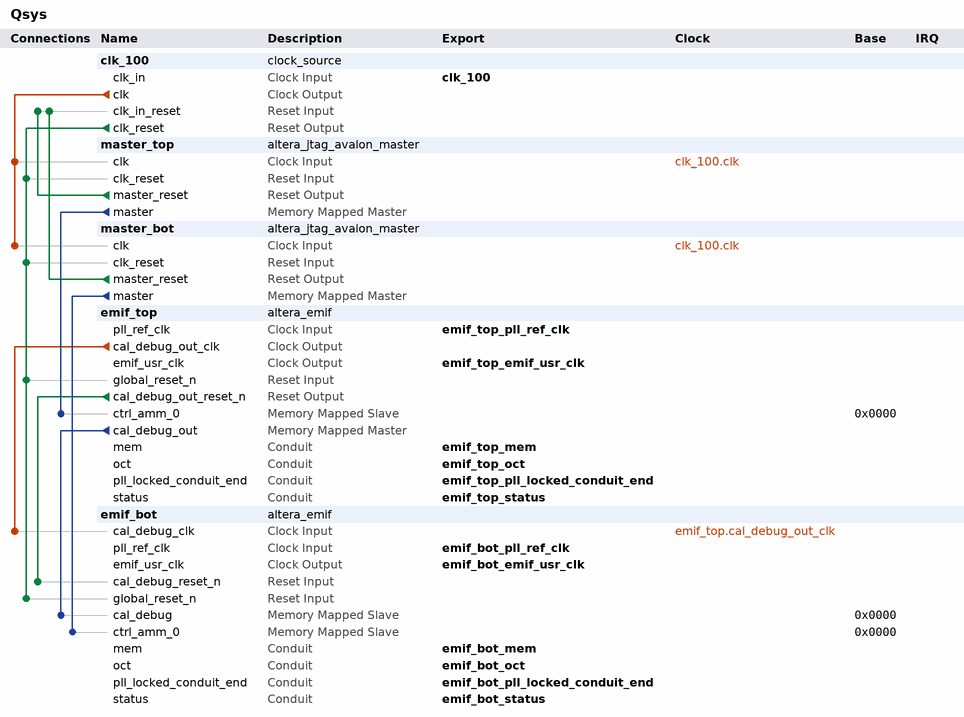
[diagram p0: system contents]
# Platform Designer (Qsys) system Qsys, Arria 10 10AXF40AA
# Parameters at their usual value, and those the tool derives, are not listed.
package require -exact qsys 20.1
create_system Qsys
set_project_property DEVICE_FAMILY {Arria 10}
set_project_property DEVICE 10AXF40AA

add_instance clk_100 clock_source 20.1
set_instance_parameter_value clk_100 clockFrequency 100000000

add_instance master_top altera_jtag_avalon_master 20.1

add_instance master_bot altera_jtag_avalon_master 20.1

add_instance emif_top altera_emif 20.1
set_instance_parameter_value emif_top BOARD_DDR3_AC_TO_CK_SKEW_NS 0.0
set_instance_parameter_value emif_top BOARD_DDR3_BRD_SKEW_WITHIN_AC_NS 0.02
set_instance_parameter_value emif_top BOARD_DDR3_BRD_SKEW_WITHIN_DQS_NS 0.02
set_instance_parameter_value emif_top BOARD_DDR3_DQS_TO_CK_SKEW_NS 0.02
set_instance_parameter_value emif_top BOARD_DDR3_IS_SKEW_WITHIN_AC_DESKEWED true
set_instance_parameter_value emif_top BOARD_DDR3_IS_SKEW_WITHIN_DQS_DESKEWED false
set_instance_parameter_value emif_top BOARD_DDR3_MAX_CK_DELAY_NS 0.6
set_instance_parameter_value emif_top BOARD_DDR3_MAX_DQS_DELAY_NS 0.6
set_instance_parameter_value emif_top BOARD_DDR3_PKG_BRD_SKEW_WITHIN_AC_NS 0.02
set_instance_parameter_value emif_top BOARD_DDR3_PKG_BRD_SKEW_WITHIN_DQS_NS 0.02
set_instance_parameter_value emif_top BOARD_DDR3_SKEW_BETWEEN_DIMMS_NS 0.05
set_instance_parameter_value emif_top BOARD_DDR3_SKEW_BETWEEN_DQS_NS 0.02
set_instance_parameter_value emif_top BOARD_DDR3_USER_AC_ISI_NS 0.0
set_instance_parameter_value emif_top BOARD_DDR3_USER_AC_SLEW_RATE 2.0
set_instance_parameter_value emif_top BOARD_DDR3_USER_CK_SLEW_RATE 4.0
set_instance_parameter_value emif_top BOARD_DDR3_USER_RCLK_ISI_NS 0.0
set_instance_parameter_value emif_top BOARD_DDR3_USER_RCLK_SLEW_RATE 5.0
set_instance_parameter_value emif_top BOARD_DDR3_USER_RDATA_ISI_NS 0.0
set_instance_parameter_value emif_top BOARD_DDR3_USER_RDATA_SLEW_RATE 2.5
set_instance_parameter_value emif_top BOARD_DDR3_USER_WCLK_ISI_NS 0.0
set_instance_parameter_value emif_top BOARD_DDR3_USER_WCLK_SLEW_RATE 4.0
set_instance_parameter_value emif_top BOARD_DDR3_USER_WDATA_ISI_NS 0.0
set_instance_parameter_value emif_top BOARD_DDR3_USER_WDATA_SLEW_RATE 2.0
set_instance_parameter_value emif_top BOARD_DDR3_USE_DEFAULT_ISI_VALUES true
set_instance_parameter_value emif_top BOARD_DDR3_USE_DEFAULT_SLEW_RATES true
set_instance_parameter_value emif_top BOARD_DDR4_AC_TO_CK_SKEW_NS 0.0
set_instance_parameter_value emif_top BOARD_DDR4_BRD_SKEW_WITHIN_AC_NS 0.02
set_instance_parameter_value emif_top BOARD_DDR4_BRD_SKEW_WITHIN_DQS_NS 0.02
set_instance_parameter_value emif_top BOARD_DDR4_DQS_TO_CK_SKEW_NS 0.02
set_instance_parameter_value emif_top BOARD_DDR4_IS_SKEW_WITHIN_AC_DESKEWED false
set_instance_parameter_value emif_top BOARD_DDR4_IS_SKEW_WITHIN_DQS_DESKEWED true
set_instance_parameter_value emif_top BOARD_DDR4_MAX_CK_DELAY_NS 0.6
set_instance_parameter_value emif_top BOARD_DDR4_MAX_DQS_DELAY_NS 0.6
set_instance_parameter_value emif_top BOARD_DDR4_PKG_BRD_SKEW_WITHIN_AC_NS 0.02
set_instance_parameter_value emif_top BOARD_DDR4_PKG_BRD_SKEW_WITHIN_DQS_NS 0.02
set_instance_parameter_value emif_top BOARD_DDR4_SKEW_BETWEEN_DIMMS_NS 0.05
set_instance_parameter_value emif_top BOARD_DDR4_SKEW_BETWEEN_DQS_NS 0.02
set_instance_parameter_value emif_top BOARD_DDR4_USER_AC_ISI_NS 0.0
set_instance_parameter_value emif_top BOARD_DDR4_USER_AC_SLEW_RATE 2.0
set_instance_parameter_value emif_top BOARD_DDR4_USER_CK_SLEW_RATE 4.0
set_instance_parameter_value emif_top BOARD_DDR4_USER_RCLK_ISI_NS 0.0
set_instance_parameter_value emif_top BOARD_DDR4_USER_RCLK_SLEW_RATE 8.0
set_instance_parameter_value emif_top BOARD_DDR4_USER_RDATA_ISI_NS 0.0
set_instance_parameter_value emif_top BOARD_DDR4_USER_RDATA_SLEW_RATE 4.0
set_instance_parameter_value emif_top BOARD_DDR4_USER_WCLK_ISI_NS 0.0
set_instance_parameter_value emif_top BOARD_DDR4_USER_WCLK_SLEW_RATE 4.0
set_instance_parameter_value emif_top BOARD_DDR4_USER_WDATA_ISI_NS 0.0
set_instance_parameter_value emif_top BOARD_DDR4_USER_WDATA_SLEW_RATE 2.0
set_instance_parameter_value emif_top BOARD_DDR4_USE_DEFAULT_ISI_VALUES true
set_instance_parameter_value emif_top BOARD_DDR4_USE_DEFAULT_SLEW_RATES true
set_instance_parameter_value emif_top BOARD_LPDDR3_AC_TO_CK_SKEW_NS 0.0
set_instance_parameter_value emif_top BOARD_LPDDR3_BRD_SKEW_WITHIN_AC_NS 0.02
set_instance_parameter_value emif_top BOARD_LPDDR3_BRD_SKEW_WITHIN_DQS_NS 0.02
set_instance_parameter_value emif_top BOARD_LPDDR3_DQS_TO_CK_SKEW_NS 0.02
set_instance_parameter_value emif_top BOARD_LPDDR3_IS_SKEW_WITHIN_AC_DESKEWED true
set_instance_parameter_value emif_top BOARD_LPDDR3_IS_SKEW_WITHIN_DQS_DESKEWED false
set_instance_parameter_value emif_top BOARD_LPDDR3_MAX_CK_DELAY_NS 0.6
set_instance_parameter_value emif_top BOARD_LPDDR3_MAX_DQS_DELAY_NS 0.6
set_instance_parameter_value emif_top BOARD_LPDDR3_PKG_BRD_SKEW_WITHIN_AC_NS 0.02
set_instance_parameter_value emif_top BOARD_LPDDR3_PKG_BRD_SKEW_WITHIN_DQS_NS 0.02
set_instance_parameter_value emif_top BOARD_LPDDR3_SKEW_BETWEEN_DIMMS_NS 0.05
set_instance_parameter_value emif_top BOARD_LPDDR3_SKEW_BETWEEN_DQS_NS 0.02
set_instance_parameter_value emif_top BOARD_LPDDR3_USER_AC_ISI_NS 0.0
set_instance_parameter_value emif_top BOARD_LPDDR3_USER_AC_SLEW_RATE 2.0
set_instance_parameter_value emif_top BOARD_LPDDR3_USER_CK_SLEW_RATE 4.0
set_instance_parameter_value emif_top BOARD_LPDDR3_USER_RCLK_ISI_NS 0.0
set_instance_parameter_value emif_top BOARD_LPDDR3_USER_RCLK_SLEW_RATE 4.0
set_instance_parameter_value emif_top BOARD_LPDDR3_USER_RDATA_ISI_NS 0.0
set_instance_parameter_value emif_top BOARD_LPDDR3_USER_RDATA_SLEW_RATE 2.0
set_instance_parameter_value emif_top BOARD_LPDDR3_USER_WCLK_ISI_NS 0.0
set_instance_parameter_value emif_top BOARD_LPDDR3_USER_WCLK_SLEW_RATE 4.0
set_instance_parameter_value emif_top BOARD_LPDDR3_USER_WDATA_ISI_NS 0.0
set_instance_parameter_value emif_top BOARD_LPDDR3_USER_WDATA_SLEW_RATE 2.0
set_instance_parameter_value emif_top BOARD_LPDDR3_USE_DEFAULT_ISI_VALUES true
set_instance_parameter_value emif_top BOARD_LPDDR3_USE_DEFAULT_SLEW_RATES true
set_instance_parameter_value emif_top BOARD_QDR2_AC_TO_K_SKEW_NS 0.0
set_instance_parameter_value emif_top BOARD_QDR2_BRD_SKEW_WITHIN_AC_NS 0.02
set_instance_parameter_value emif_top BOARD_QDR2_BRD_SKEW_WITHIN_D_NS 0.02
set_instance_parameter_value emif_top BOARD_QDR2_BRD_SKEW_WITHIN_Q_NS 0.02
set_instance_parameter_value emif_top BOARD_QDR2_IS_SKEW_WITHIN_AC_DESKEWED true
set_instance_parameter_value emif_top BOARD_QDR2_IS_SKEW_WITHIN_D_DESKEWED false
set_instance_parameter_value emif_top BOARD_QDR2_IS_SKEW_WITHIN_Q_DESKEWED false
set_instance_parameter_value emif_top BOARD_QDR2_MAX_K_DELAY_NS 0.6
set_instance_parameter_value emif_top BOARD_QDR2_PKG_BRD_SKEW_WITHIN_AC_NS 0.02
set_instance_parameter_value emif_top BOARD_QDR2_PKG_BRD_SKEW_WITHIN_D_NS 0.02
set_instance_parameter_value emif_top BOARD_QDR2_PKG_BRD_SKEW_WITHIN_Q_NS 0.02
set_instance_parameter_value emif_top BOARD_QDR2_USER_AC_ISI_NS 0.0
set_instance_parameter_value emif_top BOARD_QDR2_USER_AC_SLEW_RATE 2.0
set_instance_parameter_value emif_top BOARD_QDR2_USER_K_SLEW_RATE 4.0
set_instance_parameter_value emif_top BOARD_QDR2_USER_RCLK_ISI_NS 0.0
set_instance_parameter_value emif_top BOARD_QDR2_USER_RCLK_SLEW_RATE 4.0
set_instance_parameter_value emif_top BOARD_QDR2_USER_RDATA_ISI_NS 0.0
set_instance_parameter_value emif_top BOARD_QDR2_USER_RDATA_SLEW_RATE 2.0
set_instance_parameter_value emif_top BOARD_QDR2_USER_WCLK_ISI_NS 0.0
set_instance_parameter_value emif_top BOARD_QDR2_USER_WDATA_ISI_NS 0.0
set_instance_parameter_value emif_top BOARD_QDR2_USER_WDATA_SLEW_RATE 2.0
set_instance_parameter_value emif_top BOARD_QDR2_USE_DEFAULT_ISI_VALUES true
set_instance_parameter_value emif_top BOARD_QDR2_USE_DEFAULT_SLEW_RATES true
set_instance_parameter_value emif_top BOARD_QDR4_AC_TO_CK_SKEW_NS 0.0
set_instance_parameter_value emif_top BOARD_QDR4_BRD_SKEW_WITHIN_AC_NS 0.02
set_instance_parameter_value emif_top BOARD_QDR4_BRD_SKEW_WITHIN_QK_NS 0.02
set_instance_parameter_value emif_top BOARD_QDR4_DK_TO_CK_SKEW_NS -0.02
set_instance_parameter_value emif_top BOARD_QDR4_IS_SKEW_WITHIN_AC_DESKEWED true
set_instance_parameter_value emif_top BOARD_QDR4_IS_SKEW_WITHIN_QK_DESKEWED true
set_instance_parameter_value emif_top BOARD_QDR4_MAX_CK_DELAY_NS 0.6
set_instance_parameter_value emif_top BOARD_QDR4_MAX_DK_DELAY_NS 0.6
set_instance_parameter_value emif_top BOARD_QDR4_PKG_BRD_SKEW_WITHIN_AC_NS 0.02
set_instance_parameter_value emif_top BOARD_QDR4_PKG_BRD_SKEW_WITHIN_QK_NS 0.02
set_instance_parameter_value emif_top BOARD_QDR4_SKEW_BETWEEN_DIMMS_NS 0.05
set_instance_parameter_value emif_top BOARD_QDR4_SKEW_BETWEEN_DK_NS 0.02
set_instance_parameter_value emif_top BOARD_QDR4_USER_AC_ISI_NS 0.0
set_instance_parameter_value emif_top BOARD_QDR4_USER_AC_SLEW_RATE 2.0
set_instance_parameter_value emif_top BOARD_QDR4_USER_CK_SLEW_RATE 4.0
set_instance_parameter_value emif_top BOARD_QDR4_USER_RCLK_ISI_NS 0.0
set_instance_parameter_value emif_top BOARD_QDR4_USER_RCLK_SLEW_RATE 5.0
set_instance_parameter_value emif_top BOARD_QDR4_USER_RDATA_ISI_NS 0.0
set_instance_parameter_value emif_top BOARD_QDR4_USER_RDATA_SLEW_RATE 2.5
set_instance_parameter_value emif_top BOARD_QDR4_USER_WCLK_ISI_NS 0.0
set_instance_parameter_value emif_top BOARD_QDR4_USER_WCLK_SLEW_RATE 4.0
set_instance_parameter_value emif_top BOARD_QDR4_USER_WDATA_ISI_NS 0.0
set_instance_parameter_value emif_top BOARD_QDR4_USER_WDATA_SLEW_RATE 2.0
set_instance_parameter_value emif_top BOARD_QDR4_USE_DEFAULT_ISI_VALUES true
set_instance_parameter_value emif_top BOARD_QDR4_USE_DEFAULT_SLEW_RATES true
set_instance_parameter_value emif_top BOARD_RLD3_AC_TO_CK_SKEW_NS 0.0
set_instance_parameter_value emif_top BOARD_RLD3_BRD_SKEW_WITHIN_AC_NS 0.02
set_instance_parameter_value emif_top BOARD_RLD3_BRD_SKEW_WITHIN_QK_NS 0.02
set_instance_parameter_value emif_top BOARD_RLD3_DK_TO_CK_SKEW_NS -0.02
set_instance_parameter_value emif_top BOARD_RLD3_IS_SKEW_WITHIN_AC_DESKEWED true
set_instance_parameter_value emif_top BOARD_RLD3_IS_SKEW_WITHIN_QK_DESKEWED false
set_instance_parameter_value emif_top BOARD_RLD3_MAX_CK_DELAY_NS 0.6
set_instance_parameter_value emif_top BOARD_RLD3_MAX_DK_DELAY_NS 0.6
set_instance_parameter_value emif_top BOARD_RLD3_PKG_BRD_SKEW_WITHIN_AC_NS 0.02
set_instance_parameter_value emif_top BOARD_RLD3_PKG_BRD_SKEW_WITHIN_QK_NS 0.02
set_instance_parameter_value emif_top BOARD_RLD3_SKEW_BETWEEN_DIMMS_NS 0.05
set_instance_parameter_value emif_top BOARD_RLD3_SKEW_BETWEEN_DK_NS 0.02
set_instance_parameter_value emif_top BOARD_RLD3_USER_AC_ISI_NS 0.0
set_instance_parameter_value emif_top BOARD_RLD3_USER_AC_SLEW_RATE 2.0
set_instance_parameter_value emif_top BOARD_RLD3_USER_CK_SLEW_RATE 4.0
set_instance_parameter_value emif_top BOARD_RLD3_USER_RCLK_ISI_NS 0.0
set_instance_parameter_value emif_top BOARD_RLD3_USER_RCLK_SLEW_RATE 7.0
set_instance_parameter_value emif_top BOARD_RLD3_USER_RDATA_ISI_NS 0.0
set_instance_parameter_value emif_top BOARD_RLD3_USER_RDATA_SLEW_RATE 3.5
set_instance_parameter_value emif_top BOARD_RLD3_USER_WCLK_ISI_NS 0.0
set_instance_parameter_value emif_top BOARD_RLD3_USER_WCLK_SLEW_RATE 4.0
set_instance_parameter_value emif_top BOARD_RLD3_USER_WDATA_ISI_NS 0.0
set_instance_parameter_value emif_top BOARD_RLD3_USER_WDATA_SLEW_RATE 2.0
set_instance_parameter_value emif_top BOARD_RLD3_USE_DEFAULT_ISI_VALUES true
set_instance_parameter_value emif_top BOARD_RLD3_USE_DEFAULT_SLEW_RATES true
set_instance_parameter_value emif_top CAL_DEBUG_CLOCK_FREQUENCY 50000000
set_instance_parameter_value emif_top CTRL_DDR3_ADDR_ORDER_ENUM DDR3_CTRL_ADDR_ORDER_CS_R_B_C
set_instance_parameter_value emif_top CTRL_DDR3_AUTO_POWER_DOWN_CYCS 32
set_instance_parameter_value emif_top CTRL_DDR3_AUTO_POWER_DOWN_EN false
set_instance_parameter_value emif_top CTRL_DDR3_AUTO_PRECHARGE_EN false
set_instance_parameter_value emif_top CTRL_DDR3_AVL_PROTOCOL_ENUM CTRL_AVL_PROTOCOL_MM
set_instance_parameter_value emif_top CTRL_DDR3_ECC_AUTO_CORRECTION_EN false
set_instance_parameter_value emif_top CTRL_DDR3_ECC_EN false
set_instance_parameter_value emif_top CTRL_DDR3_MMR_EN false
set_instance_parameter_value emif_top CTRL_DDR3_RD_TO_RD_DIFF_CHIP_DELTA_CYCS 0
set_instance_parameter_value emif_top CTRL_DDR3_RD_TO_WR_DIFF_CHIP_DELTA_CYCS 0
set_instance_parameter_value emif_top CTRL_DDR3_RD_TO_WR_SAME_CHIP_DELTA_CYCS 0
set_instance_parameter_value emif_top CTRL_DDR3_REORDER_EN true
set_instance_parameter_value emif_top CTRL_DDR3_SELF_REFRESH_EN false
set_instance_parameter_value emif_top CTRL_DDR3_STARVE_LIMIT 10
set_instance_parameter_value emif_top CTRL_DDR3_USER_PRIORITY_EN false
set_instance_parameter_value emif_top CTRL_DDR3_USER_REFRESH_EN false
set_instance_parameter_value emif_top CTRL_DDR3_WR_TO_RD_DIFF_CHIP_DELTA_CYCS 0
set_instance_parameter_value emif_top CTRL_DDR3_WR_TO_RD_SAME_CHIP_DELTA_CYCS 0
set_instance_parameter_value emif_top CTRL_DDR3_WR_TO_WR_DIFF_CHIP_DELTA_CYCS 0
set_instance_parameter_value emif_top CTRL_DDR4_ADDR_ORDER_ENUM DDR4_CTRL_ADDR_ORDER_CS_R_B_C_BG
set_instance_parameter_value emif_top CTRL_DDR4_AUTO_POWER_DOWN_CYCS 32
set_instance_parameter_value emif_top CTRL_DDR4_AUTO_POWER_DOWN_EN false
set_instance_parameter_value emif_top CTRL_DDR4_AUTO_PRECHARGE_EN false
set_instance_parameter_value emif_top CTRL_DDR4_AVL_PROTOCOL_ENUM CTRL_AVL_PROTOCOL_MM
set_instance_parameter_value emif_top CTRL_DDR4_ECC_AUTO_CORRECTION_EN true
set_instance_parameter_value emif_top CTRL_DDR4_ECC_EN true
set_instance_parameter_value emif_top CTRL_DDR4_MMR_EN false
set_instance_parameter_value emif_top CTRL_DDR4_RD_TO_RD_DIFF_CHIP_DELTA_CYCS 0
set_instance_parameter_value emif_top CTRL_DDR4_RD_TO_WR_DIFF_CHIP_DELTA_CYCS 0
set_instance_parameter_value emif_top CTRL_DDR4_RD_TO_WR_SAME_CHIP_DELTA_CYCS 0
set_instance_parameter_value emif_top CTRL_DDR4_REORDER_EN true
set_instance_parameter_value emif_top CTRL_DDR4_SELF_REFRESH_EN false
set_instance_parameter_value emif_top CTRL_DDR4_STARVE_LIMIT 10
set_instance_parameter_value emif_top CTRL_DDR4_USER_PRIORITY_EN false
set_instance_parameter_value emif_top CTRL_DDR4_USER_REFRESH_EN false
set_instance_parameter_value emif_top CTRL_DDR4_WR_TO_RD_DIFF_CHIP_DELTA_CYCS 0
set_instance_parameter_value emif_top CTRL_DDR4_WR_TO_RD_SAME_CHIP_DELTA_CYCS 0
set_instance_parameter_value emif_top CTRL_DDR4_WR_TO_WR_DIFF_CHIP_DELTA_CYCS 0
set_instance_parameter_value emif_top CTRL_LPDDR3_ADDR_ORDER_ENUM LPDDR3_CTRL_ADDR_ORDER_CS_R_B_C
set_instance_parameter_value emif_top CTRL_LPDDR3_AUTO_POWER_DOWN_CYCS 32
set_instance_parameter_value emif_top CTRL_LPDDR3_AUTO_POWER_DOWN_EN false
set_instance_parameter_value emif_top CTRL_LPDDR3_AUTO_PRECHARGE_EN false
set_instance_parameter_value emif_top CTRL_LPDDR3_AVL_PROTOCOL_ENUM CTRL_AVL_PROTOCOL_MM
set_instance_parameter_value emif_top CTRL_LPDDR3_MMR_EN false
set_instance_parameter_value emif_top CTRL_LPDDR3_RD_TO_RD_DIFF_CHIP_DELTA_CYCS 0
set_instance_parameter_value emif_top CTRL_LPDDR3_RD_TO_WR_DIFF_CHIP_DELTA_CYCS 0
set_instance_parameter_value emif_top CTRL_LPDDR3_RD_TO_WR_SAME_CHIP_DELTA_CYCS 0
set_instance_parameter_value emif_top CTRL_LPDDR3_REORDER_EN true
set_instance_parameter_value emif_top CTRL_LPDDR3_SELF_REFRESH_EN false
set_instance_parameter_value emif_top CTRL_LPDDR3_STARVE_LIMIT 10
set_instance_parameter_value emif_top CTRL_LPDDR3_USER_PRIORITY_EN false
set_instance_parameter_value emif_top CTRL_LPDDR3_USER_REFRESH_EN false
set_instance_parameter_value emif_top CTRL_LPDDR3_WR_TO_RD_DIFF_CHIP_DELTA_CYCS 0
set_instance_parameter_value emif_top CTRL_LPDDR3_WR_TO_RD_SAME_CHIP_DELTA_CYCS 0
set_instance_parameter_value emif_top CTRL_LPDDR3_WR_TO_WR_DIFF_CHIP_DELTA_CYCS 0
set_instance_parameter_value emif_top CTRL_QDR2_AVL_ENABLE_POWER_OF_TWO_BUS false
set_instance_parameter_value emif_top CTRL_QDR2_AVL_MAX_BURST_COUNT 4
set_instance_parameter_value emif_top CTRL_QDR2_AVL_PROTOCOL_ENUM CTRL_AVL_PROTOCOL_MM
set_instance_parameter_value emif_top CTRL_QDR4_ADD_RAW_TURNAROUND_DELAY_CYC 0
set_instance_parameter_value emif_top CTRL_QDR4_ADD_WAR_TURNAROUND_DELAY_CYC 0
set_instance_parameter_value emif_top CTRL_QDR4_AVL_ENABLE_POWER_OF_TWO_BUS false
set_instance_parameter_value emif_top CTRL_QDR4_AVL_MAX_BURST_COUNT 4
set_instance_parameter_value emif_top CTRL_QDR4_AVL_PROTOCOL_ENUM CTRL_AVL_PROTOCOL_MM
set_instance_parameter_value emif_top CTRL_RLD2_AVL_PROTOCOL_ENUM CTRL_AVL_PROTOCOL_MM
set_instance_parameter_value emif_top CTRL_RLD3_ADDR_ORDER_ENUM RLD3_CTRL_ADDR_ORDER_CS_R_B_C
set_instance_parameter_value emif_top CTRL_RLD3_AVL_PROTOCOL_ENUM CTRL_AVL_PROTOCOL_MM
set_instance_parameter_value emif_top DIAG_DDR3_ABSTRACT_PHY false
set_instance_parameter_value emif_top DIAG_DDR3_BYPASS_DEFAULT_PATTERN false
set_instance_parameter_value emif_top DIAG_DDR3_BYPASS_REPEAT_STAGE true
set_instance_parameter_value emif_top DIAG_DDR3_BYPASS_STRESS_STAGE true
set_instance_parameter_value emif_top DIAG_DDR3_BYPASS_USER_STAGE true
set_instance_parameter_value emif_top DIAG_DDR3_CAL_ADDR0 0
set_instance_parameter_value emif_top DIAG_DDR3_CAL_ADDR1 8
set_instance_parameter_value emif_top DIAG_DDR3_CAL_ENABLE_NON_DES false
set_instance_parameter_value emif_top DIAG_DDR3_CAL_FULL_CAL_ON_RESET true
set_instance_parameter_value emif_top DIAG_DDR3_CA_LEVEL_EN false
set_instance_parameter_value emif_top DIAG_DDR3_EFFICIENCY_MONITOR EFFMON_MODE_DISABLED
set_instance_parameter_value emif_top DIAG_DDR3_EXPORT_SEQ_AVALON_MASTER false
set_instance_parameter_value emif_top DIAG_DDR3_EXPORT_SEQ_AVALON_SLAVE CAL_DEBUG_EXPORT_MODE_DISABLED
set_instance_parameter_value emif_top DIAG_DDR3_EX_DESIGN_ISSP_EN true
set_instance_parameter_value emif_top DIAG_DDR3_EX_DESIGN_NUM_OF_SLAVES 1
set_instance_parameter_value emif_top DIAG_DDR3_EX_DESIGN_SEPARATE_RZQS false
set_instance_parameter_value emif_top DIAG_DDR3_INTERFACE_ID 0
set_instance_parameter_value emif_top DIAG_DDR3_SEPARATE_READ_WRITE_ITFS false
set_instance_parameter_value emif_top DIAG_DDR3_SIM_CAL_MODE_ENUM SIM_CAL_MODE_SKIP
set_instance_parameter_value emif_top DIAG_DDR3_TG_BE_PATTERN_LENGTH 8
set_instance_parameter_value emif_top DIAG_DDR3_TG_DATA_PATTERN_LENGTH 8
set_instance_parameter_value emif_top DIAG_DDR3_USE_TG_AVL_2 false
set_instance_parameter_value emif_top DIAG_DDR4_ABSTRACT_PHY false
set_instance_parameter_value emif_top DIAG_DDR4_BYPASS_DEFAULT_PATTERN false
set_instance_parameter_value emif_top DIAG_DDR4_BYPASS_REPEAT_STAGE true
set_instance_parameter_value emif_top DIAG_DDR4_BYPASS_STRESS_STAGE true
set_instance_parameter_value emif_top DIAG_DDR4_BYPASS_USER_STAGE true
set_instance_parameter_value emif_top DIAG_DDR4_CAL_ADDR0 0
set_instance_parameter_value emif_top DIAG_DDR4_CAL_ADDR1 8
set_instance_parameter_value emif_top DIAG_DDR4_CAL_ENABLE_NON_DES false
set_instance_parameter_value emif_top DIAG_DDR4_CAL_FULL_CAL_ON_RESET true
set_instance_parameter_value emif_top DIAG_DDR4_EFFICIENCY_MONITOR EFFMON_MODE_DISABLED
set_instance_parameter_value emif_top DIAG_DDR4_EXPORT_SEQ_AVALON_MASTER true
set_instance_parameter_value emif_top DIAG_DDR4_EXPORT_SEQ_AVALON_SLAVE CAL_DEBUG_EXPORT_MODE_JTAG
set_instance_parameter_value emif_top DIAG_DDR4_EX_DESIGN_ISSP_EN false
set_instance_parameter_value emif_top DIAG_DDR4_EX_DESIGN_NUM_OF_SLAVES 1
set_instance_parameter_value emif_top DIAG_DDR4_EX_DESIGN_SEPARATE_RZQS false
set_instance_parameter_value emif_top DIAG_DDR4_INTERFACE_ID 0
set_instance_parameter_value emif_top DIAG_DDR4_SEPARATE_READ_WRITE_ITFS false
set_instance_parameter_value emif_top DIAG_DDR4_SIM_CAL_MODE_ENUM SIM_CAL_MODE_SKIP
set_instance_parameter_value emif_top DIAG_DDR4_SKIP_CA_DESKEW false
set_instance_parameter_value emif_top DIAG_DDR4_SKIP_CA_LEVEL false
set_instance_parameter_value emif_top DIAG_DDR4_SKIP_VREF_CAL false
set_instance_parameter_value emif_top DIAG_DDR4_TG_BE_PATTERN_LENGTH 8
set_instance_parameter_value emif_top DIAG_DDR4_TG_DATA_PATTERN_LENGTH 8
set_instance_parameter_value emif_top DIAG_DDR4_USE_TG_AVL_2 false
set_instance_parameter_value emif_top DIAG_ECLIPSE_DEBUG false
set_instance_parameter_value emif_top DIAG_ENABLE_HPS_EMIF_DEBUG false
set_instance_parameter_value emif_top DIAG_ENABLE_JTAG_UART false
set_instance_parameter_value emif_top DIAG_ENABLE_JTAG_UART_HEX false
set_instance_parameter_value emif_top DIAG_EXPORT_VJI false
set_instance_parameter_value emif_top DIAG_EXPOSE_DFT_SIGNALS false
set_instance_parameter_value emif_top DIAG_EXT_DOCS false
set_instance_parameter_value emif_top DIAG_EX_DESIGN_SEPARATE_RESETS false
set_instance_parameter_value emif_top DIAG_FAST_SIM_OVERRIDE FAST_SIM_OVERRIDE_DEFAULT
set_instance_parameter_value emif_top DIAG_LPDDR3_ABSTRACT_PHY false
set_instance_parameter_value emif_top DIAG_LPDDR3_BYPASS_DEFAULT_PATTERN false
set_instance_parameter_value emif_top DIAG_LPDDR3_BYPASS_REPEAT_STAGE true
set_instance_parameter_value emif_top DIAG_LPDDR3_BYPASS_STRESS_STAGE true
set_instance_parameter_value emif_top DIAG_LPDDR3_BYPASS_USER_STAGE true
set_instance_parameter_value emif_top DIAG_LPDDR3_EFFICIENCY_MONITOR EFFMON_MODE_DISABLED
set_instance_parameter_value emif_top DIAG_LPDDR3_EXPORT_SEQ_AVALON_MASTER false
set_instance_parameter_value emif_top DIAG_LPDDR3_EXPORT_SEQ_AVALON_SLAVE CAL_DEBUG_EXPORT_MODE_DISABLED
set_instance_parameter_value emif_top DIAG_LPDDR3_EX_DESIGN_ISSP_EN true
set_instance_parameter_value emif_top DIAG_LPDDR3_EX_DESIGN_NUM_OF_SLAVES 1
set_instance_parameter_value emif_top DIAG_LPDDR3_EX_DESIGN_SEPARATE_RZQS false
set_instance_parameter_value emif_top DIAG_LPDDR3_INTERFACE_ID 0
set_instance_parameter_value emif_top DIAG_LPDDR3_SEPARATE_READ_WRITE_ITFS false
set_instance_parameter_value emif_top DIAG_LPDDR3_SIM_CAL_MODE_ENUM SIM_CAL_MODE_SKIP
set_instance_parameter_value emif_top DIAG_LPDDR3_SKIP_CA_DESKEW false
set_instance_parameter_value emif_top DIAG_LPDDR3_SKIP_CA_LEVEL false
set_instance_parameter_value emif_top DIAG_LPDDR3_TG_BE_PATTERN_LENGTH 8
set_instance_parameter_value emif_top DIAG_LPDDR3_TG_DATA_PATTERN_LENGTH 8
set_instance_parameter_value emif_top DIAG_LPDDR3_USE_TG_AVL_2 false
set_instance_parameter_value emif_top DIAG_QDR2_ABSTRACT_PHY false
set_instance_parameter_value emif_top DIAG_QDR2_BYPASS_DEFAULT_PATTERN false
set_instance_parameter_value emif_top DIAG_QDR2_BYPASS_REPEAT_STAGE true
set_instance_parameter_value emif_top DIAG_QDR2_BYPASS_STRESS_STAGE true
set_instance_parameter_value emif_top DIAG_QDR2_BYPASS_USER_STAGE true
set_instance_parameter_value emif_top DIAG_QDR2_EFFICIENCY_MONITOR EFFMON_MODE_DISABLED
set_instance_parameter_value emif_top DIAG_QDR2_EXPORT_SEQ_AVALON_MASTER false
set_instance_parameter_value emif_top DIAG_QDR2_EXPORT_SEQ_AVALON_SLAVE CAL_DEBUG_EXPORT_MODE_DISABLED
set_instance_parameter_value emif_top DIAG_QDR2_EX_DESIGN_ISSP_EN true
set_instance_parameter_value emif_top DIAG_QDR2_EX_DESIGN_NUM_OF_SLAVES 1
set_instance_parameter_value emif_top DIAG_QDR2_EX_DESIGN_SEPARATE_RZQS false
set_instance_parameter_value emif_top DIAG_QDR2_INTERFACE_ID 0
set_instance_parameter_value emif_top DIAG_QDR2_SEPARATE_READ_WRITE_ITFS false
set_instance_parameter_value emif_top DIAG_QDR2_SIM_CAL_MODE_ENUM SIM_CAL_MODE_SKIP
set_instance_parameter_value emif_top DIAG_QDR2_TG_BE_PATTERN_LENGTH 8
set_instance_parameter_value emif_top DIAG_QDR2_TG_DATA_PATTERN_LENGTH 8
set_instance_parameter_value emif_top DIAG_QDR2_USE_TG_AVL_2 false
set_instance_parameter_value emif_top DIAG_QDR4_ABSTRACT_PHY false
set_instance_parameter_value emif_top DIAG_QDR4_BYPASS_DEFAULT_PATTERN false
set_instance_parameter_value emif_top DIAG_QDR4_BYPASS_REPEAT_STAGE true
set_instance_parameter_value emif_top DIAG_QDR4_BYPASS_STRESS_STAGE true
set_instance_parameter_value emif_top DIAG_QDR4_BYPASS_USER_STAGE true
set_instance_parameter_value emif_top DIAG_QDR4_EFFICIENCY_MONITOR EFFMON_MODE_DISABLED
set_instance_parameter_value emif_top DIAG_QDR4_EXPORT_SEQ_AVALON_MASTER false
set_instance_parameter_value emif_top DIAG_QDR4_EXPORT_SEQ_AVALON_SLAVE CAL_DEBUG_EXPORT_MODE_DISABLED
set_instance_parameter_value emif_top DIAG_QDR4_EX_DESIGN_ISSP_EN true
set_instance_parameter_value emif_top DIAG_QDR4_EX_DESIGN_NUM_OF_SLAVES 1
set_instance_parameter_value emif_top DIAG_QDR4_EX_DESIGN_SEPARATE_RZQS false
set_instance_parameter_value emif_top DIAG_QDR4_INTERFACE_ID 0
set_instance_parameter_value emif_top DIAG_QDR4_SEPARATE_READ_WRITE_ITFS false
set_instance_parameter_value emif_top DIAG_QDR4_SIM_CAL_MODE_ENUM SIM_CAL_MODE_SKIP
set_instance_parameter_value emif_top DIAG_QDR4_SKIP_VREF_CAL false
set_instance_parameter_value emif_top DIAG_QDR4_TG_BE_PATTERN_LENGTH 8
set_instance_parameter_value emif_top DIAG_QDR4_TG_DATA_PATTERN_LENGTH 8
set_instance_parameter_value emif_top DIAG_QDR4_USE_TG_AVL_2 false
set_instance_parameter_value emif_top DIAG_RLD2_ABSTRACT_PHY false
set_instance_parameter_value emif_top DIAG_RLD2_BYPASS_DEFAULT_PATTERN false
set_instance_parameter_value emif_top DIAG_RLD2_BYPASS_REPEAT_STAGE true
set_instance_parameter_value emif_top DIAG_RLD2_BYPASS_STRESS_STAGE true
set_instance_parameter_value emif_top DIAG_RLD2_BYPASS_USER_STAGE true
set_instance_parameter_value emif_top DIAG_RLD2_EFFICIENCY_MONITOR EFFMON_MODE_DISABLED
set_instance_parameter_value emif_top DIAG_RLD2_EXPORT_SEQ_AVALON_MASTER false
set_instance_parameter_value emif_top DIAG_RLD2_EXPORT_SEQ_AVALON_SLAVE CAL_DEBUG_EXPORT_MODE_DISABLED
set_instance_parameter_value emif_top DIAG_RLD2_EX_DESIGN_ISSP_EN true
set_instance_parameter_value emif_top DIAG_RLD2_EX_DESIGN_NUM_OF_SLAVES 1
set_instance_parameter_value emif_top DIAG_RLD2_EX_DESIGN_SEPARATE_RZQS false
set_instance_parameter_value emif_top DIAG_RLD2_INTERFACE_ID 0
set_instance_parameter_value emif_top DIAG_RLD2_SEPARATE_READ_WRITE_ITFS false
set_instance_parameter_value emif_top DIAG_RLD2_SIM_CAL_MODE_ENUM SIM_CAL_MODE_SKIP
set_instance_parameter_value emif_top DIAG_RLD2_TG_BE_PATTERN_LENGTH 8
set_instance_parameter_value emif_top DIAG_RLD2_TG_DATA_PATTERN_LENGTH 8
set_instance_parameter_value emif_top DIAG_RLD2_USE_TG_AVL_2 false
set_instance_parameter_value emif_top DIAG_RLD3_ABSTRACT_PHY false
set_instance_parameter_value emif_top DIAG_RLD3_BYPASS_DEFAULT_PATTERN false
set_instance_parameter_value emif_top DIAG_RLD3_BYPASS_REPEAT_STAGE true
set_instance_parameter_value emif_top DIAG_RLD3_BYPASS_STRESS_STAGE true
set_instance_parameter_value emif_top DIAG_RLD3_BYPASS_USER_STAGE true
set_instance_parameter_value emif_top DIAG_RLD3_EFFICIENCY_MONITOR EFFMON_MODE_DISABLED
set_instance_parameter_value emif_top DIAG_RLD3_EXPORT_SEQ_AVALON_MASTER false
set_instance_parameter_value emif_top DIAG_RLD3_EXPORT_SEQ_AVALON_SLAVE CAL_DEBUG_EXPORT_MODE_DISABLED
set_instance_parameter_value emif_top DIAG_RLD3_EX_DESIGN_ISSP_EN true
set_instance_parameter_value emif_top DIAG_RLD3_EX_DESIGN_NUM_OF_SLAVES 1
set_instance_parameter_value emif_top DIAG_RLD3_EX_DESIGN_SEPARATE_RZQS false
set_instance_parameter_value emif_top DIAG_RLD3_INTERFACE_ID 0
set_instance_parameter_value emif_top DIAG_RLD3_SEPARATE_READ_WRITE_ITFS false
set_instance_parameter_value emif_top DIAG_RLD3_SIM_CAL_MODE_ENUM SIM_CAL_MODE_SKIP
set_instance_parameter_value emif_top DIAG_RLD3_TG_BE_PATTERN_LENGTH 8
set_instance_parameter_value emif_top DIAG_RLD3_TG_DATA_PATTERN_LENGTH 8
set_instance_parameter_value emif_top DIAG_RLD3_USE_TG_AVL_2 false
set_instance_parameter_value emif_top DIAG_RS232_UART_BAUDRATE 57600
set_instance_parameter_value emif_top DIAG_SIM_REGTEST_MODE false
set_instance_parameter_value emif_top DIAG_SOFT_NIOS_CLOCK_FREQUENCY 100
set_instance_parameter_value emif_top DIAG_SOFT_NIOS_MODE SOFT_NIOS_MODE_DISABLED
set_instance_parameter_value emif_top DIAG_SYNTH_FOR_SIM false
set_instance_parameter_value emif_top DIAG_TG_AVL_2_EXPORT_CFG_INTERFACE false
set_instance_parameter_value emif_top DIAG_TG_AVL_2_NUM_CFG_INTERFACES 0
set_instance_parameter_value emif_top DIAG_TIMING_REGTEST_MODE false
set_instance_parameter_value emif_top DIAG_USE_BOARD_DELAY_MODEL false
set_instance_parameter_value emif_top DIAG_USE_RS232_UART false
set_instance_parameter_value emif_top DIAG_VERBOSE_IOAUX false
set_instance_parameter_value emif_top EX_DESIGN_GUI_DDR3_GEN_SIM true
set_instance_parameter_value emif_top EX_DESIGN_GUI_DDR3_GEN_SYNTH true
set_instance_parameter_value emif_top EX_DESIGN_GUI_DDR3_HDL_FORMAT HDL_FORMAT_VERILOG
set_instance_parameter_value emif_top EX_DESIGN_GUI_DDR3_PREV_PRESET TARGET_DEV_KIT_NONE
set_instance_parameter_value emif_top EX_DESIGN_GUI_DDR3_SEL_DESIGN AVAIL_EX_DESIGNS_GEN_DESIGN
set_instance_parameter_value emif_top EX_DESIGN_GUI_DDR3_TARGET_DEV_KIT TARGET_DEV_KIT_NONE
set_instance_parameter_value emif_top EX_DESIGN_GUI_DDR4_GEN_SIM false
set_instance_parameter_value emif_top EX_DESIGN_GUI_DDR4_GEN_SYNTH false
set_instance_parameter_value emif_top EX_DESIGN_GUI_DDR4_HDL_FORMAT HDL_FORMAT_VERILOG
set_instance_parameter_value emif_top EX_DESIGN_GUI_DDR4_PREV_PRESET TARGET_DEV_KIT_NONE
set_instance_parameter_value emif_top EX_DESIGN_GUI_DDR4_SEL_DESIGN AVAIL_EX_DESIGNS_GEN_DESIGN
set_instance_parameter_value emif_top EX_DESIGN_GUI_DDR4_TARGET_DEV_KIT TARGET_DEV_KIT_NONE
set_instance_parameter_value emif_top EX_DESIGN_GUI_LPDDR3_GEN_SIM true
set_instance_parameter_value emif_top EX_DESIGN_GUI_LPDDR3_GEN_SYNTH true
set_instance_parameter_value emif_top EX_DESIGN_GUI_LPDDR3_HDL_FORMAT HDL_FORMAT_VERILOG
set_instance_parameter_value emif_top EX_DESIGN_GUI_LPDDR3_PREV_PRESET TARGET_DEV_KIT_NONE
set_instance_parameter_value emif_top EX_DESIGN_GUI_LPDDR3_SEL_DESIGN AVAIL_EX_DESIGNS_GEN_DESIGN
set_instance_parameter_value emif_top EX_DESIGN_GUI_LPDDR3_TARGET_DEV_KIT TARGET_DEV_KIT_NONE
set_instance_parameter_value emif_top EX_DESIGN_GUI_QDR2_GEN_SIM true
set_instance_parameter_value emif_top EX_DESIGN_GUI_QDR2_GEN_SYNTH true
set_instance_parameter_value emif_top EX_DESIGN_GUI_QDR2_HDL_FORMAT HDL_FORMAT_VERILOG
set_instance_parameter_value emif_top EX_DESIGN_GUI_QDR2_PREV_PRESET TARGET_DEV_KIT_NONE
set_instance_parameter_value emif_top EX_DESIGN_GUI_QDR2_SEL_DESIGN AVAIL_EX_DESIGNS_GEN_DESIGN
set_instance_parameter_value emif_top EX_DESIGN_GUI_QDR2_TARGET_DEV_KIT TARGET_DEV_KIT_NONE
set_instance_parameter_value emif_top EX_DESIGN_GUI_QDR4_GEN_SIM true
set_instance_parameter_value emif_top EX_DESIGN_GUI_QDR4_GEN_SYNTH true
set_instance_parameter_value emif_top EX_DESIGN_GUI_QDR4_HDL_FORMAT HDL_FORMAT_VERILOG
set_instance_parameter_value emif_top EX_DESIGN_GUI_QDR4_PREV_PRESET TARGET_DEV_KIT_NONE
set_instance_parameter_value emif_top EX_DESIGN_GUI_QDR4_SEL_DESIGN AVAIL_EX_DESIGNS_GEN_DESIGN
set_instance_parameter_value emif_top EX_DESIGN_GUI_QDR4_TARGET_DEV_KIT TARGET_DEV_KIT_NONE
set_instance_parameter_value emif_top EX_DESIGN_GUI_RLD2_GEN_SIM true
set_instance_parameter_value emif_top EX_DESIGN_GUI_RLD2_GEN_SYNTH true
set_instance_parameter_value emif_top EX_DESIGN_GUI_RLD2_HDL_FORMAT HDL_FORMAT_VERILOG
set_instance_parameter_value emif_top EX_DESIGN_GUI_RLD2_PREV_PRESET TARGET_DEV_KIT_NONE
set_instance_parameter_value emif_top EX_DESIGN_GUI_RLD2_SEL_DESIGN AVAIL_EX_DESIGNS_GEN_DESIGN
set_instance_parameter_value emif_top EX_DESIGN_GUI_RLD2_TARGET_DEV_KIT TARGET_DEV_KIT_NONE
set_instance_parameter_value emif_top EX_DESIGN_GUI_RLD3_GEN_SIM true
set_instance_parameter_value emif_top EX_DESIGN_GUI_RLD3_GEN_SYNTH true
set_instance_parameter_value emif_top EX_DESIGN_GUI_RLD3_HDL_FORMAT HDL_FORMAT_VERILOG
set_instance_parameter_value emif_top EX_DESIGN_GUI_RLD3_PREV_PRESET TARGET_DEV_KIT_NONE
set_instance_parameter_value emif_top EX_DESIGN_GUI_RLD3_SEL_DESIGN AVAIL_EX_DESIGNS_GEN_DESIGN
set_instance_parameter_value emif_top EX_DESIGN_GUI_RLD3_TARGET_DEV_KIT TARGET_DEV_KIT_NONE
set_instance_parameter_value emif_top INTERNAL_TESTING_MODE false
set_instance_parameter_value emif_top IS_ED_SLAVE false
set_instance_parameter_value emif_top MEM_DDR3_ALERT_N_DQS_GROUP 0
set_instance_parameter_value emif_top MEM_DDR3_ALERT_N_PLACEMENT_ENUM DDR3_ALERT_N_PLACEMENT_AC_LANES
set_instance_parameter_value emif_top MEM_DDR3_ASR_ENUM DDR3_ASR_MANUAL
set_instance_parameter_value emif_top MEM_DDR3_ATCL_ENUM DDR3_ATCL_DISABLED
set_instance_parameter_value emif_top MEM_DDR3_BANK_ADDR_WIDTH 3
set_instance_parameter_value emif_top MEM_DDR3_BL_ENUM DDR3_BL_BL8
set_instance_parameter_value emif_top MEM_DDR3_BT_ENUM DDR3_BT_SEQUENTIAL
set_instance_parameter_value emif_top MEM_DDR3_CKE_PER_DIMM 1
set_instance_parameter_value emif_top MEM_DDR3_CK_WIDTH 1
set_instance_parameter_value emif_top MEM_DDR3_COL_ADDR_WIDTH 10
set_instance_parameter_value emif_top MEM_DDR3_DISCRETE_CS_WIDTH 1
set_instance_parameter_value emif_top MEM_DDR3_DISCRETE_MIRROR_ADDRESSING_EN false
set_instance_parameter_value emif_top MEM_DDR3_DLL_EN true
set_instance_parameter_value emif_top MEM_DDR3_DM_EN true
set_instance_parameter_value emif_top MEM_DDR3_DQ_PER_DQS 8
set_instance_parameter_value emif_top MEM_DDR3_DQ_WIDTH 72
set_instance_parameter_value emif_top MEM_DDR3_DRV_STR_ENUM DDR3_DRV_STR_RZQ_7
set_instance_parameter_value emif_top MEM_DDR3_FORMAT_ENUM MEM_FORMAT_UDIMM
set_instance_parameter_value emif_top MEM_DDR3_HIDE_ADV_MR_SETTINGS true
set_instance_parameter_value emif_top MEM_DDR3_LRDIMM_EXTENDED_CONFIG 000000000000000000
set_instance_parameter_value emif_top MEM_DDR3_MIRROR_ADDRESSING_EN true
set_instance_parameter_value emif_top MEM_DDR3_NUM_OF_DIMMS 1
set_instance_parameter_value emif_top MEM_DDR3_PD_ENUM DDR3_PD_OFF
set_instance_parameter_value emif_top MEM_DDR3_RANKS_PER_DIMM 1
set_instance_parameter_value emif_top MEM_DDR3_RDIMM_CONFIG 0000000000000000
set_instance_parameter_value emif_top MEM_DDR3_ROW_ADDR_WIDTH 15
set_instance_parameter_value emif_top MEM_DDR3_RTT_NOM_ENUM DDR3_RTT_NOM_ODT_DISABLED
set_instance_parameter_value emif_top MEM_DDR3_RTT_WR_ENUM DDR3_RTT_WR_RZQ_4
set_instance_parameter_value emif_top MEM_DDR3_R_ODT0_1X1 off
set_instance_parameter_value emif_top MEM_DDR3_R_ODT0_2X2 off,off
set_instance_parameter_value emif_top MEM_DDR3_R_ODT0_4X2 off,off,on,on
set_instance_parameter_value emif_top MEM_DDR3_R_ODT0_4X4 off,off,off,off
set_instance_parameter_value emif_top MEM_DDR3_R_ODT1_2X2 off,off
set_instance_parameter_value emif_top MEM_DDR3_R_ODT1_4X2 on,on,off,off
set_instance_parameter_value emif_top MEM_DDR3_R_ODT1_4X4 off,off,on,on
set_instance_parameter_value emif_top MEM_DDR3_R_ODT2_4X4 off,off,off,off
set_instance_parameter_value emif_top MEM_DDR3_R_ODT3_4X4 on,on,off,off
set_instance_parameter_value emif_top MEM_DDR3_R_ODTN_1X1 {Rank 0}
set_instance_parameter_value emif_top MEM_DDR3_R_ODTN_2X2 {Rank 0,Rank 1}
set_instance_parameter_value emif_top MEM_DDR3_R_ODTN_4X2 {Rank 0,Rank 1,Rank 2,Rank 3}
set_instance_parameter_value emif_top MEM_DDR3_R_ODTN_4X4 {Rank 0,Rank 1,Rank 2,Rank 3}
set_instance_parameter_value emif_top MEM_DDR3_SPEEDBIN_ENUM DDR3_SPEEDBIN_2133
set_instance_parameter_value emif_top MEM_DDR3_SRT_ENUM DDR3_SRT_NORMAL
set_instance_parameter_value emif_top MEM_DDR3_TCL 14
set_instance_parameter_value emif_top MEM_DDR3_TDH_DC_MV 100
set_instance_parameter_value emif_top MEM_DDR3_TDH_PS 55
set_instance_parameter_value emif_top MEM_DDR3_TDQSCK_PS 180
set_instance_parameter_value emif_top MEM_DDR3_TDQSQ_PS 75
set_instance_parameter_value emif_top MEM_DDR3_TDQSS_CYC 0.27
set_instance_parameter_value emif_top MEM_DDR3_TDSH_CYC 0.18
set_instance_parameter_value emif_top MEM_DDR3_TDSS_CYC 0.18
set_instance_parameter_value emif_top MEM_DDR3_TDS_AC_MV 135
set_instance_parameter_value emif_top MEM_DDR3_TDS_PS 53
set_instance_parameter_value emif_top MEM_DDR3_TFAW_NS 25.0
set_instance_parameter_value emif_top MEM_DDR3_TIH_DC_MV 100
set_instance_parameter_value emif_top MEM_DDR3_TIH_PS 95
set_instance_parameter_value emif_top MEM_DDR3_TINIT_US 500
set_instance_parameter_value emif_top MEM_DDR3_TIS_AC_MV 135
set_instance_parameter_value emif_top MEM_DDR3_TIS_PS 60
set_instance_parameter_value emif_top MEM_DDR3_TMRD_CK_CYC 4
set_instance_parameter_value emif_top MEM_DDR3_TQH_CYC 0.38
set_instance_parameter_value emif_top MEM_DDR3_TQSH_CYC 0.4
set_instance_parameter_value emif_top MEM_DDR3_TRAS_NS 33.0
set_instance_parameter_value emif_top MEM_DDR3_TRCD_NS 13.09
set_instance_parameter_value emif_top MEM_DDR3_TREFI_US 7.8
set_instance_parameter_value emif_top MEM_DDR3_TRFC_NS 160.0
set_instance_parameter_value emif_top MEM_DDR3_TRP_NS 13.09
set_instance_parameter_value emif_top MEM_DDR3_TRRD_CYC 6
set_instance_parameter_value emif_top MEM_DDR3_TRTP_CYC 8
set_instance_parameter_value emif_top MEM_DDR3_TWLH_PS 125.0
set_instance_parameter_value emif_top MEM_DDR3_TWLS_PS 125.0
set_instance_parameter_value emif_top MEM_DDR3_TWR_NS 15.0
set_instance_parameter_value emif_top MEM_DDR3_TWTR_CYC 8
set_instance_parameter_value emif_top MEM_DDR3_USE_DEFAULT_ODT true
set_instance_parameter_value emif_top MEM_DDR3_WTCL 10
set_instance_parameter_value emif_top MEM_DDR3_W_ODT0_1X1 on
set_instance_parameter_value emif_top MEM_DDR3_W_ODT0_2X2 on,off
set_instance_parameter_value emif_top MEM_DDR3_W_ODT0_4X2 off,off,on,on
set_instance_parameter_value emif_top MEM_DDR3_W_ODT0_4X4 on,on,off,off
set_instance_parameter_value emif_top MEM_DDR3_W_ODT1_2X2 off,on
set_instance_parameter_value emif_top MEM_DDR3_W_ODT1_4X2 on,on,off,off
set_instance_parameter_value emif_top MEM_DDR3_W_ODT1_4X4 off,off,on,on
set_instance_parameter_value emif_top MEM_DDR3_W_ODT2_4X4 off,off,on,on
set_instance_parameter_value emif_top MEM_DDR3_W_ODT3_4X4 on,on,off,off
set_instance_parameter_value emif_top MEM_DDR3_W_ODTN_1X1 {Rank 0}
set_instance_parameter_value emif_top MEM_DDR3_W_ODTN_2X2 {Rank 0,Rank 1}
set_instance_parameter_value emif_top MEM_DDR3_W_ODTN_4X2 {Rank 0,Rank 1,Rank 2,Rank 3}
set_instance_parameter_value emif_top MEM_DDR3_W_ODTN_4X4 {Rank 0,Rank 1,Rank 2,Rank 3}
set_instance_parameter_value emif_top MEM_DDR4_AC_PARITY_LATENCY DDR4_AC_PARITY_LATENCY_DISABLE
set_instance_parameter_value emif_top MEM_DDR4_AC_PERSISTENT_ERROR false
set_instance_parameter_value emif_top MEM_DDR4_ALERT_N_AC_LANE 0
set_instance_parameter_value emif_top MEM_DDR4_ALERT_N_AC_PIN 0
set_instance_parameter_value emif_top MEM_DDR4_ALERT_N_DQS_GROUP 0
set_instance_parameter_value emif_top MEM_DDR4_ALERT_N_PLACEMENT_ENUM DDR4_ALERT_N_PLACEMENT_AUTO
set_instance_parameter_value emif_top MEM_DDR4_ALERT_PAR_EN true
set_instance_parameter_value emif_top MEM_DDR4_ASR_ENUM DDR4_ASR_MANUAL_NORMAL
set_instance_parameter_value emif_top MEM_DDR4_ATCL_ENUM DDR4_ATCL_DISABLED
set_instance_parameter_value emif_top MEM_DDR4_BANK_ADDR_WIDTH 2
set_instance_parameter_value emif_top MEM_DDR4_BANK_GROUP_WIDTH 1
set_instance_parameter_value emif_top MEM_DDR4_BL_ENUM DDR4_BL_BL8
set_instance_parameter_value emif_top MEM_DDR4_BT_ENUM DDR4_BT_SEQUENTIAL
set_instance_parameter_value emif_top MEM_DDR4_CAL_MODE 0
set_instance_parameter_value emif_top MEM_DDR4_CHIP_ID_WIDTH 0
set_instance_parameter_value emif_top MEM_DDR4_CKE_PER_DIMM 1
set_instance_parameter_value emif_top MEM_DDR4_CK_WIDTH 1
set_instance_parameter_value emif_top MEM_DDR4_COL_ADDR_WIDTH 10
set_instance_parameter_value emif_top MEM_DDR4_DB_DQ_DRV_ENUM DDR4_DB_DRV_STR_RZQ_7
set_instance_parameter_value emif_top MEM_DDR4_DB_RTT_NOM_ENUM DDR4_DB_RTT_NOM_ODT_DISABLED
set_instance_parameter_value emif_top MEM_DDR4_DB_RTT_PARK_ENUM DDR4_DB_RTT_PARK_ODT_DISABLED
set_instance_parameter_value emif_top MEM_DDR4_DB_RTT_WR_ENUM DDR4_DB_RTT_WR_RZQ_3
set_instance_parameter_value emif_top MEM_DDR4_DEFAULT_VREFOUT true
set_instance_parameter_value emif_top MEM_DDR4_DISCRETE_CS_WIDTH 1
set_instance_parameter_value emif_top MEM_DDR4_DISCRETE_MIRROR_ADDRESSING_EN false
set_instance_parameter_value emif_top MEM_DDR4_DLL_EN true
set_instance_parameter_value emif_top MEM_DDR4_DM_EN true
set_instance_parameter_value emif_top MEM_DDR4_DQ_PER_DQS 8
set_instance_parameter_value emif_top MEM_DDR4_DQ_WIDTH 72
set_instance_parameter_value emif_top MEM_DDR4_DRV_STR_ENUM DDR4_DRV_STR_RZQ_7
set_instance_parameter_value emif_top MEM_DDR4_FINE_GRANULARITY_REFRESH DDR4_FINE_REFRESH_FIXED_1X
set_instance_parameter_value emif_top MEM_DDR4_FORMAT_ENUM MEM_FORMAT_DISCRETE
set_instance_parameter_value emif_top MEM_DDR4_GEARDOWN DDR4_GEARDOWN_HR
set_instance_parameter_value emif_top MEM_DDR4_HIDE_ADV_MR_SETTINGS true
set_instance_parameter_value emif_top MEM_DDR4_INTERNAL_VREFDQ_MONITOR false
set_instance_parameter_value emif_top MEM_DDR4_LRDIMM_ODT_LESS_BS true
set_instance_parameter_value emif_top MEM_DDR4_LRDIMM_ODT_LESS_BS_PARK_OHM 240
set_instance_parameter_value emif_top MEM_DDR4_MAX_POWERDOWN false
set_instance_parameter_value emif_top MEM_DDR4_MIRROR_ADDRESSING_EN true
set_instance_parameter_value emif_top MEM_DDR4_MPR_READ_FORMAT DDR4_MPR_READ_FORMAT_SERIAL
set_instance_parameter_value emif_top MEM_DDR4_NUM_OF_DIMMS 1
set_instance_parameter_value emif_top MEM_DDR4_ODT_IN_POWERDOWN true
set_instance_parameter_value emif_top MEM_DDR4_PER_DRAM_ADDR false
set_instance_parameter_value emif_top MEM_DDR4_RANKS_PER_DIMM 1
set_instance_parameter_value emif_top MEM_DDR4_RCD_CA_IBT_ENUM DDR4_RCD_CA_IBT_100
set_instance_parameter_value emif_top MEM_DDR4_RCD_CKE_IBT_ENUM DDR4_RCD_CKE_IBT_100
set_instance_parameter_value emif_top MEM_DDR4_RCD_CS_IBT_ENUM DDR4_RCD_CS_IBT_100
set_instance_parameter_value emif_top MEM_DDR4_RCD_ODT_IBT_ENUM DDR4_RCD_ODT_IBT_100
set_instance_parameter_value emif_top MEM_DDR4_READ_DBI true
set_instance_parameter_value emif_top MEM_DDR4_READ_PREAMBLE 2
set_instance_parameter_value emif_top MEM_DDR4_READ_PREAMBLE_TRAINING false
set_instance_parameter_value emif_top MEM_DDR4_ROW_ADDR_WIDTH 15
set_instance_parameter_value emif_top MEM_DDR4_RTT_NOM_ENUM DDR4_RTT_NOM_RZQ_4
set_instance_parameter_value emif_top MEM_DDR4_RTT_PARK DDR4_RTT_PARK_ODT_DISABLED
set_instance_parameter_value emif_top MEM_DDR4_RTT_WR_ENUM DDR4_RTT_WR_ODT_DISABLED
set_instance_parameter_value emif_top MEM_DDR4_R_ODT0_1X1 off
set_instance_parameter_value emif_top MEM_DDR4_R_ODT0_2X2 off,off
set_instance_parameter_value emif_top MEM_DDR4_R_ODT0_4X2 off,off,on,on
set_instance_parameter_value emif_top MEM_DDR4_R_ODT0_4X4 off,off,off,off
set_instance_parameter_value emif_top MEM_DDR4_R_ODT1_2X2 off,off
set_instance_parameter_value emif_top MEM_DDR4_R_ODT1_4X2 on,on,off,off
set_instance_parameter_value emif_top MEM_DDR4_R_ODT1_4X4 off,off,on,on
set_instance_parameter_value emif_top MEM_DDR4_R_ODT2_4X4 off,off,off,off
set_instance_parameter_value emif_top MEM_DDR4_R_ODT3_4X4 on,on,off,off
set_instance_parameter_value emif_top MEM_DDR4_R_ODTN_1X1 {Rank 0}
set_instance_parameter_value emif_top MEM_DDR4_R_ODTN_2X2 {Rank 0,Rank 1}
set_instance_parameter_value emif_top MEM_DDR4_R_ODTN_4X2 {Rank 0,Rank 1,Rank 2,Rank 3}
set_instance_parameter_value emif_top MEM_DDR4_R_ODTN_4X4 {Rank 0,Rank 1,Rank 2,Rank 3}
set_instance_parameter_value emif_top MEM_DDR4_SELF_RFSH_ABORT false
set_instance_parameter_value emif_top MEM_DDR4_SPD_133_RCD_DB_VENDOR_LSB 0
set_instance_parameter_value emif_top MEM_DDR4_SPD_134_RCD_DB_VENDOR_MSB 0
set_instance_parameter_value emif_top MEM_DDR4_SPD_135_RCD_REV 0
set_instance_parameter_value emif_top MEM_DDR4_SPD_137_RCD_CA_DRV 101
set_instance_parameter_value emif_top MEM_DDR4_SPD_138_RCD_CK_DRV 5
set_instance_parameter_value emif_top MEM_DDR4_SPD_139_DB_REV 0
set_instance_parameter_value emif_top MEM_DDR4_SPD_140_DRAM_VREFDQ_R0 29
set_instance_parameter_value emif_top MEM_DDR4_SPD_141_DRAM_VREFDQ_R1 29
set_instance_parameter_value emif_top MEM_DDR4_SPD_142_DRAM_VREFDQ_R2 29
set_instance_parameter_value emif_top MEM_DDR4_SPD_143_DRAM_VREFDQ_R3 29
set_instance_parameter_value emif_top MEM_DDR4_SPD_144_DB_VREFDQ 37
set_instance_parameter_value emif_top MEM_DDR4_SPD_145_DB_MDQ_DRV 21
set_instance_parameter_value emif_top MEM_DDR4_SPD_148_DRAM_DRV 0
set_instance_parameter_value emif_top MEM_DDR4_SPD_149_DRAM_RTT_WR_NOM 20
set_instance_parameter_value emif_top MEM_DDR4_SPD_152_DRAM_RTT_PARK 39
set_instance_parameter_value emif_top MEM_DDR4_SPEEDBIN_ENUM DDR4_SPEEDBIN_2133
set_instance_parameter_value emif_top MEM_DDR4_TCCD_L_CYC 6
set_instance_parameter_value emif_top MEM_DDR4_TCCD_S_CYC 4
set_instance_parameter_value emif_top MEM_DDR4_TCL 15
set_instance_parameter_value emif_top MEM_DDR4_TDIVW_DJ_CYC 0.1
set_instance_parameter_value emif_top MEM_DDR4_TDIVW_TOTAL_UI 0.2
set_instance_parameter_value emif_top MEM_DDR4_TDQSCK_PS 180
set_instance_parameter_value emif_top MEM_DDR4_TDQSQ_PS 66
set_instance_parameter_value emif_top MEM_DDR4_TDQSQ_UI 0.16
set_instance_parameter_value emif_top MEM_DDR4_TDQSS_CYC 0.27
set_instance_parameter_value emif_top MEM_DDR4_TDSH_CYC 0.18
set_instance_parameter_value emif_top MEM_DDR4_TDSS_CYC 0.18
set_instance_parameter_value emif_top MEM_DDR4_TDVWP_UI 0.69
set_instance_parameter_value emif_top MEM_DDR4_TEMP_CONTROLLED_RFSH_ENA false
set_instance_parameter_value emif_top MEM_DDR4_TEMP_CONTROLLED_RFSH_RANGE DDR4_TEMP_CONTROLLED_RFSH_NORMAL
set_instance_parameter_value emif_top MEM_DDR4_TEMP_SENSOR_READOUT false
set_instance_parameter_value emif_top MEM_DDR4_TFAW_NS 30.0
set_instance_parameter_value emif_top MEM_DDR4_TIH_DC_MV 75
set_instance_parameter_value emif_top MEM_DDR4_TIH_PS 95
set_instance_parameter_value emif_top MEM_DDR4_TINIT_US 500
set_instance_parameter_value emif_top MEM_DDR4_TIS_AC_MV 100
set_instance_parameter_value emif_top MEM_DDR4_TIS_PS 60
set_instance_parameter_value emif_top MEM_DDR4_TMRD_CK_CYC 8
set_instance_parameter_value emif_top MEM_DDR4_TQH_CYC 0.38
set_instance_parameter_value emif_top MEM_DDR4_TQH_UI 0.76
set_instance_parameter_value emif_top MEM_DDR4_TQSH_CYC 0.38
set_instance_parameter_value emif_top MEM_DDR4_TRAS_NS 33.0
set_instance_parameter_value emif_top MEM_DDR4_TRCD_NS 14.06
set_instance_parameter_value emif_top MEM_DDR4_TREFI_US 7.8
set_instance_parameter_value emif_top MEM_DDR4_TRFC_NS 260.0
set_instance_parameter_value emif_top MEM_DDR4_TRP_NS 14.06
set_instance_parameter_value emif_top MEM_DDR4_TRRD_L_CYC 7
set_instance_parameter_value emif_top MEM_DDR4_TRRD_S_CYC 6
set_instance_parameter_value emif_top MEM_DDR4_TWLH_PS 125.0
set_instance_parameter_value emif_top MEM_DDR4_TWLS_PS 125.0
set_instance_parameter_value emif_top MEM_DDR4_TWR_NS 15.0
set_instance_parameter_value emif_top MEM_DDR4_TWTR_L_CYC 8
set_instance_parameter_value emif_top MEM_DDR4_TWTR_S_CYC 3
set_instance_parameter_value emif_top MEM_DDR4_USER_VREFDQ_TRAINING_RANGE DDR4_VREFDQ_TRAINING_RANGE_1
set_instance_parameter_value emif_top MEM_DDR4_USER_VREFDQ_TRAINING_VALUE 56.0
set_instance_parameter_value emif_top MEM_DDR4_USE_DEFAULT_ODT true
set_instance_parameter_value emif_top MEM_DDR4_VDIVW_TOTAL 136
set_instance_parameter_value emif_top MEM_DDR4_WRITE_CRC false
set_instance_parameter_value emif_top MEM_DDR4_WRITE_DBI false
set_instance_parameter_value emif_top MEM_DDR4_WRITE_PREAMBLE 1
set_instance_parameter_value emif_top MEM_DDR4_WTCL 12
set_instance_parameter_value emif_top MEM_DDR4_W_ODT0_1X1 on
set_instance_parameter_value emif_top MEM_DDR4_W_ODT0_2X2 on,off
set_instance_parameter_value emif_top MEM_DDR4_W_ODT0_4X2 off,off,on,on
set_instance_parameter_value emif_top MEM_DDR4_W_ODT0_4X4 on,on,off,off
set_instance_parameter_value emif_top MEM_DDR4_W_ODT1_2X2 off,on
set_instance_parameter_value emif_top MEM_DDR4_W_ODT1_4X2 on,on,off,off
set_instance_parameter_value emif_top MEM_DDR4_W_ODT1_4X4 off,off,on,on
set_instance_parameter_value emif_top MEM_DDR4_W_ODT2_4X4 off,off,on,on
set_instance_parameter_value emif_top MEM_DDR4_W_ODT3_4X4 on,on,off,off
set_instance_parameter_value emif_top MEM_DDR4_W_ODTN_1X1 {Rank 0}
set_instance_parameter_value emif_top MEM_DDR4_W_ODTN_2X2 {Rank 0,Rank 1}
set_instance_parameter_value emif_top MEM_DDR4_W_ODTN_4X2 {Rank 0,Rank 1,Rank 2,Rank 3}
set_instance_parameter_value emif_top MEM_DDR4_W_ODTN_4X4 {Rank 0,Rank 1,Rank 2,Rank 3}
set_instance_parameter_value emif_top MEM_LPDDR3_BANK_ADDR_WIDTH 3
set_instance_parameter_value emif_top MEM_LPDDR3_BL LPDDR3_BL_BL8
set_instance_parameter_value emif_top MEM_LPDDR3_CK_WIDTH 1
set_instance_parameter_value emif_top MEM_LPDDR3_COL_ADDR_WIDTH 10
set_instance_parameter_value emif_top MEM_LPDDR3_DATA_LATENCY LPDDR3_DL_RL12_WL6
set_instance_parameter_value emif_top MEM_LPDDR3_DISCRETE_CS_WIDTH 1
set_instance_parameter_value emif_top MEM_LPDDR3_DM_EN true
set_instance_parameter_value emif_top MEM_LPDDR3_DQODT LPDDR3_DQODT_DISABLE
set_instance_parameter_value emif_top MEM_LPDDR3_DQ_WIDTH 32
set_instance_parameter_value emif_top MEM_LPDDR3_DRV_STR LPDDR3_DRV_STR_40D_40U
set_instance_parameter_value emif_top MEM_LPDDR3_PDODT LPDDR3_PDODT_DISABLED
set_instance_parameter_value emif_top MEM_LPDDR3_ROW_ADDR_WIDTH 15
set_instance_parameter_value emif_top MEM_LPDDR3_R_ODT0_1X1 off
set_instance_parameter_value emif_top MEM_LPDDR3_R_ODT0_2X2 off,off
set_instance_parameter_value emif_top MEM_LPDDR3_R_ODT0_4X4 off,off,off,off
set_instance_parameter_value emif_top MEM_LPDDR3_R_ODT1_2X2 off,off
set_instance_parameter_value emif_top MEM_LPDDR3_R_ODT1_4X4 off,off,off,off
set_instance_parameter_value emif_top MEM_LPDDR3_R_ODT2_4X4 off,off,off,off
set_instance_parameter_value emif_top MEM_LPDDR3_R_ODT3_4X4 off,off,off,off
set_instance_parameter_value emif_top MEM_LPDDR3_R_ODTN_1X1 {Rank 0}
set_instance_parameter_value emif_top MEM_LPDDR3_R_ODTN_2X2 {Rank 0,Rank 1}
set_instance_parameter_value emif_top MEM_LPDDR3_R_ODTN_4X4 {Rank 0,Rank 1,Rank 2,Rank 3}
set_instance_parameter_value emif_top MEM_LPDDR3_SPEEDBIN_ENUM LPDDR3_SPEEDBIN_1600
set_instance_parameter_value emif_top MEM_LPDDR3_TDH_DC_MV 100
set_instance_parameter_value emif_top MEM_LPDDR3_TDH_PS 100
set_instance_parameter_value emif_top MEM_LPDDR3_TDQSCKDL 614
set_instance_parameter_value emif_top MEM_LPDDR3_TDQSQ_PS 135
